# EasyEDA Pro project 交换机工具.epro, schematic Schematic1
Board Name: Board1; Create Date: 2026-06-15; Page Name: P1; Project Name: switch_tool2; Schematic Name: Schematic1; Update Date: 2026-06-25; Company: 嘉立创EDA; Page Size: A4; Version: V1.0
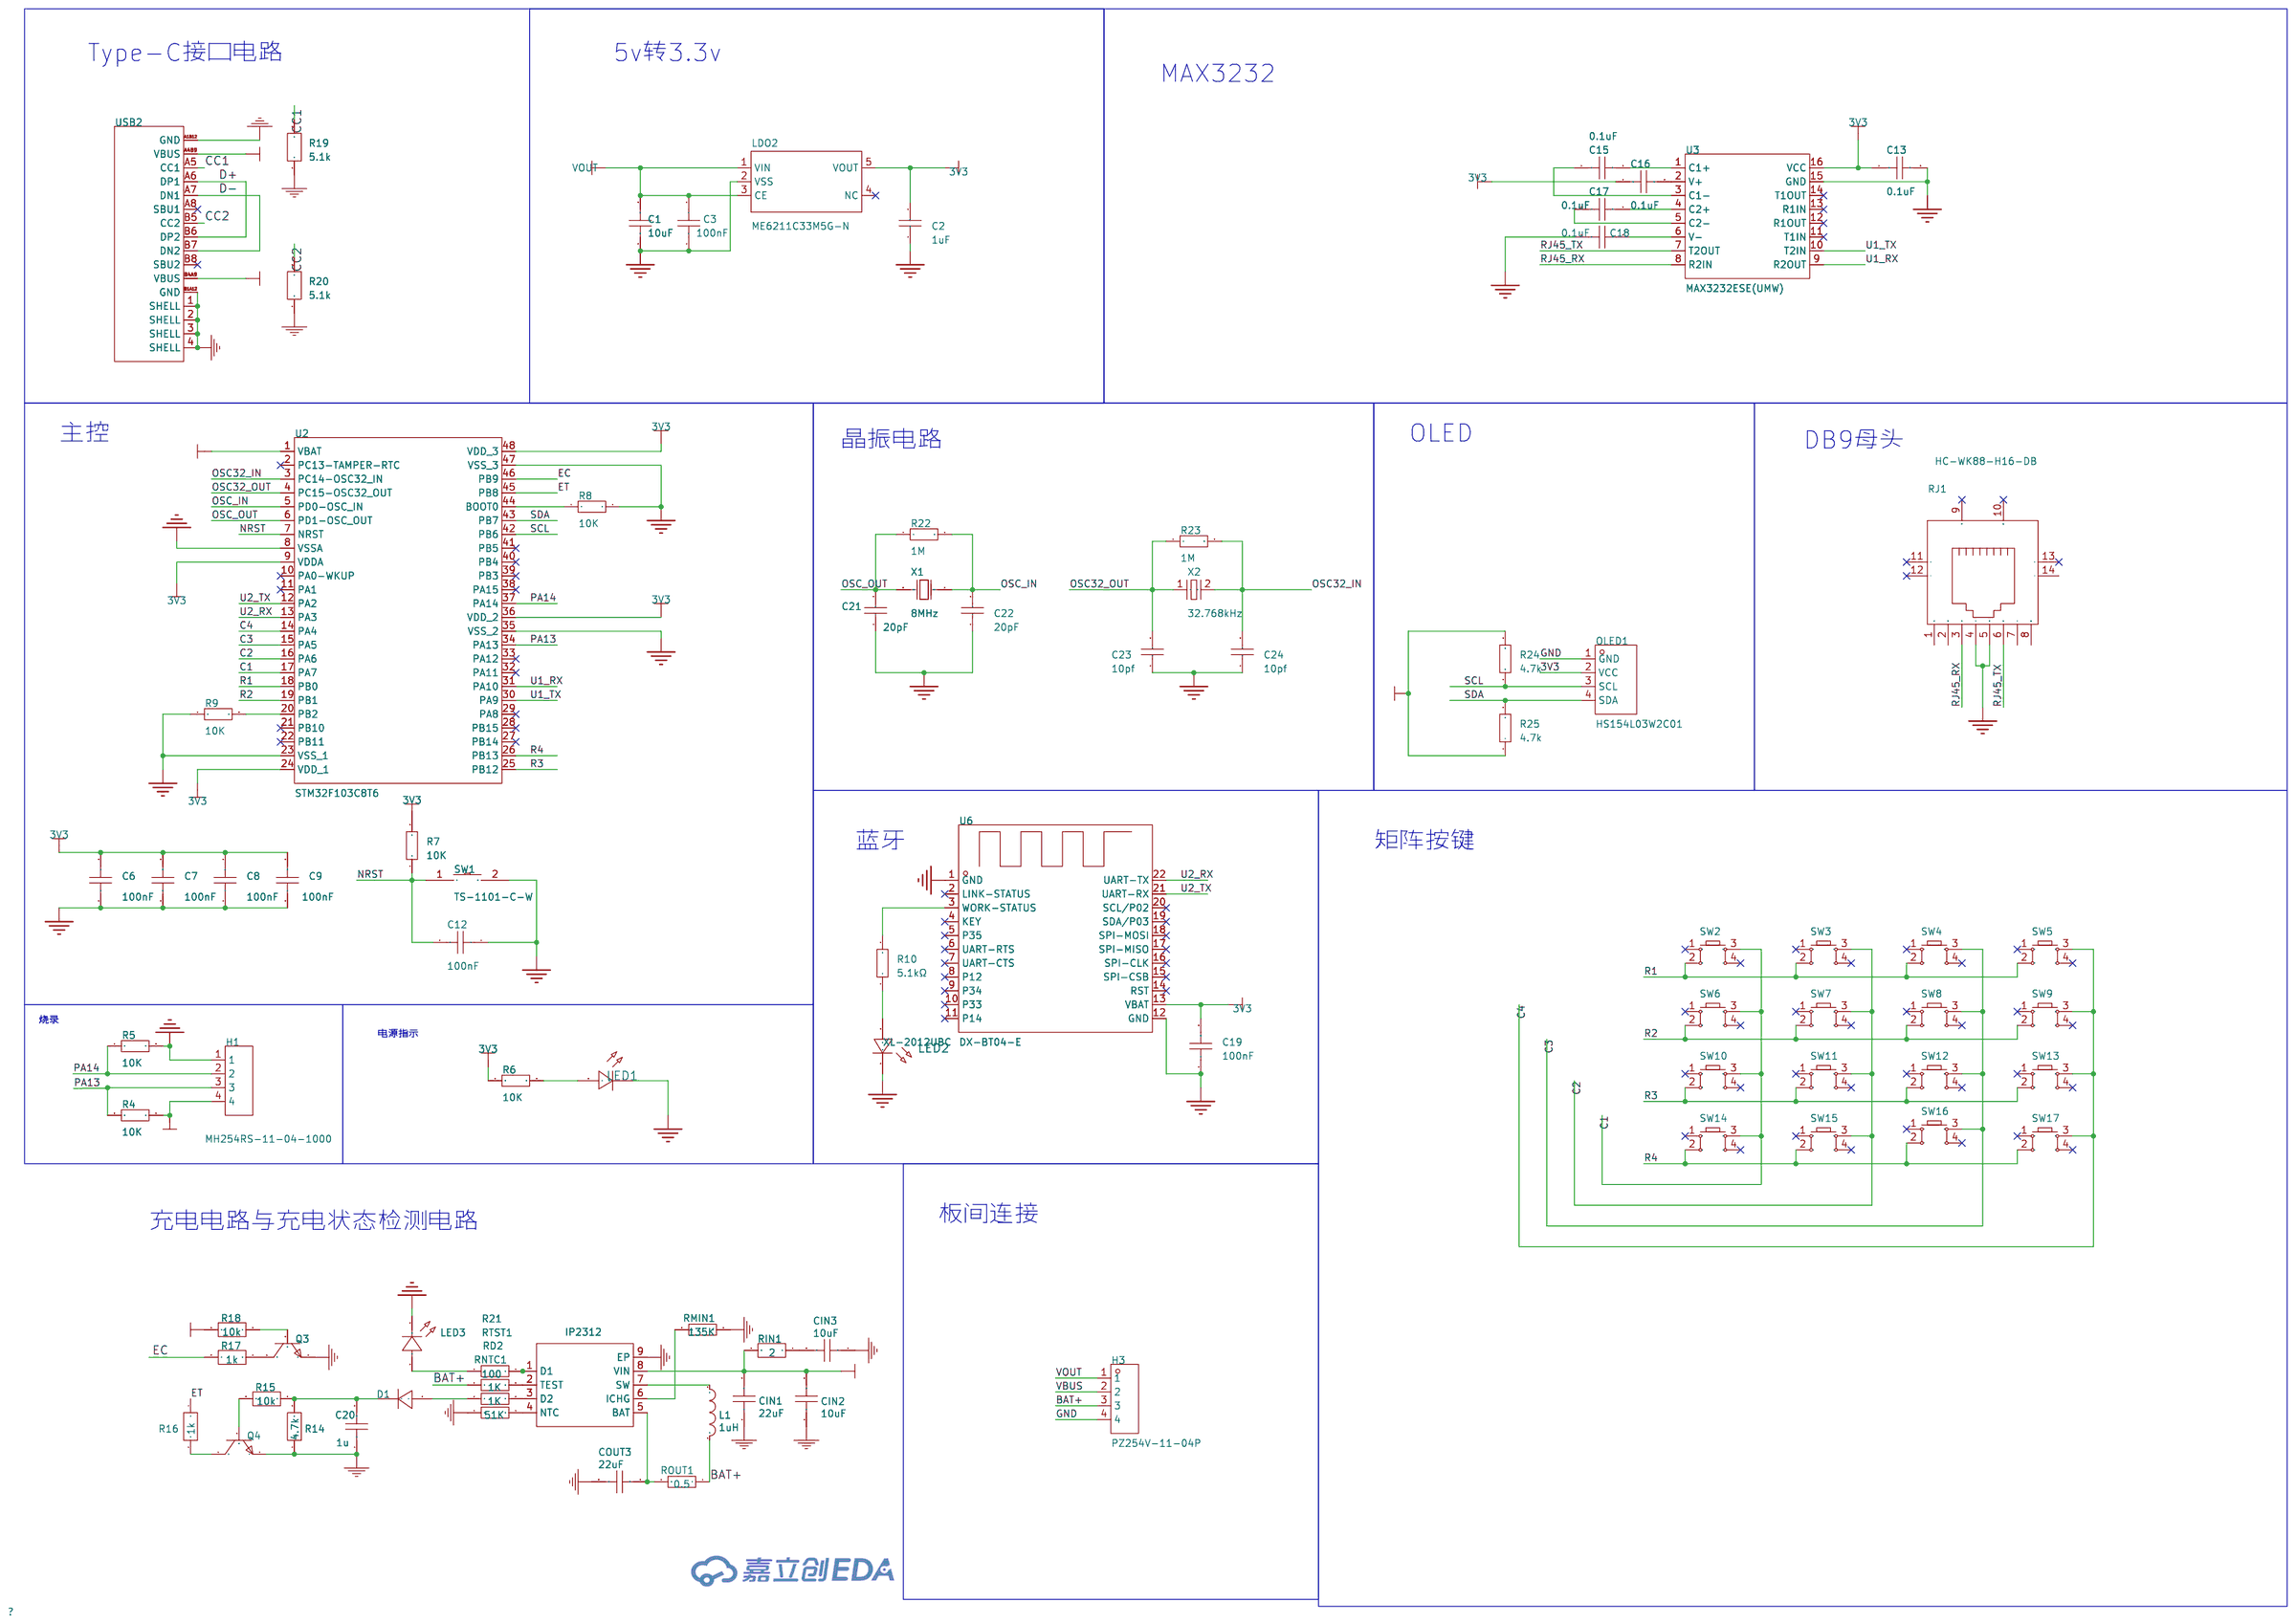
[diagram p1: schematic sheet]

## Parts
C1  10uF  [C0805]
C2  1uF  [C0805]
C3  100nF  [C0805]
C6  100nF  [C0805]
C7  100nF  [C0805]
C8  100nF  [C0805]
C9  100nF  [C0805]
C12  100nF  [C0805]
C13  0.1uF  [C0805]
C15  0.1uF  [C0805]
C16  0.1uF  [C0805]
C17  0.1uF  [C0805]
C18  0.1uF  [C0805]
C19  100nF  [C0805]
C20  1u  [C0805]
C21  20pF  [C0805]
C22  20pF  [C0805]
C23  10pf  [C0805]
C24  10pf  [C0805]
CIN1  22uF  [C0805]
CIN2  10uF  [C0805]
CIN3  10uF  [C0805]
COUT3  22uF  [C0805]
D1  1N4148W  [SOD-123F_L2.7-W1.6-LS3.8-RD]
H1  MH254RS-11-04-1000  [HDR-SMD_MH254RS-11-04-1000]
H3  PZ254V-11-04P  [HDR-TH_4P-P2.54-V-M]
IP2312  IP2312U_VSET  [SOP-8_L4.9-W3.9-P1.27-LS6.0-BL-EP]
L1  1uH  [IND-SMD_L4.6-W4.1_MHCI04015]
LDO2  ME6211C33M5G-N  [SOT-23-5_L3.0-W1.7-P0.95-LS2.8-BL]
LED1  -  [LED_0805]
LED2  XL-2012UBC  [LED_0805]
LED3  XL-2012UYC  [LED_0805]
OLED1  HS154L03W2C01  [OLED-TH_-4P-L42.4-W38.0-P2.54]
Q3  S8050  [SOT-23-3_L3.0-W1.7-P0.95-LS2.9-BR]
Q4  S8050-J3Y  [SOT-23-3_L2.9-W1.3-P0.95-LS2.4-BR-1]
R4  10K  [R0805]
R5  10K  [R0805]
R6  10K  [R0805]
R7  10K  [R0805]
R8  10K  [R0805]
R9  10K  [R0805]
R10  5.1kΩ  [R0805]
R14  4.7k  [R0805]
R15  10k  [R0805]
R16  1k  [R0805]
R17  1k  [R0805]
R18  10k  [R0805]
R19  5.1k  [R0805]
R20  5.1k  [R0805]
R21  100  [R0805]
R22  1M  [R0805]
R23  1M  [R0805]
R24  4.7k  [R0805]
R25  4.7k  [R0805]
RD2  1K  [R0805]
RIN1  2  [R0805]
RJ1  HC-WK88-H16-DB  [RJ45-TH_HC-WK88-H16-DB]
RMIN1  135K  [R0805]
RNTC1  51K  [R0805]
ROUT1  0.5  [R0805]
RTST1  1K  [R0805]
SW1  TS-1101-C-W  [SW-SMD_HX-TS-1101-C-W]
SW2  KH-6X6X5H-STM  [SW-SMD_4P-L6.0-W6.0-P4.50-LS9.0_H5.0]
SW3  KH-6X6X5H-STM  [SW-SMD_4P-L6.0-W6.0-P4.50-LS9.0_H5.0]
SW4  KH-6X6X5H-STM  [SW-SMD_4P-L6.0-W6.0-P4.50-LS9.0_H5.0]
SW5  KH-6X6X5H-STM  [SW-SMD_4P-L6.0-W6.0-P4.50-LS9.0_H5.0]
SW6  KH-6X6X5H-STM  [SW-SMD_4P-L6.0-W6.0-P4.50-LS9.0_H5.0]
SW7  KH-6X6X5H-STM  [SW-SMD_4P-L6.0-W6.0-P4.50-LS9.0_H5.0]
SW8  KH-6X6X5H-STM  [SW-SMD_4P-L6.0-W6.0-P4.50-LS9.0_H5.0]
SW9  KH-6X6X5H-STM  [SW-SMD_4P-L6.0-W6.0-P4.50-LS9.0_H5.0]
SW10  KH-6X6X5H-STM  [SW-SMD_4P-L6.0-W6.0-P4.50-LS9.0_H5.0]
SW11  KH-6X6X5H-STM  [SW-SMD_4P-L6.0-W6.0-P4.50-LS9.0_H5.0]
SW12  KH-6X6X5H-STM  [SW-SMD_4P-L6.0-W6.0-P4.50-LS9.0_H5.0]
SW13  KH-6X6X5H-STM  [SW-SMD_4P-L6.0-W6.0-P4.50-LS9.0_H5.0]
SW14  KH-6X6X5H-STM  [SW-SMD_4P-L6.0-W6.0-P4.50-LS9.0_H5.0]
SW15  KH-6X6X5H-STM  [SW-SMD_4P-L6.0-W6.0-P4.50-LS9.0_H5.0]
SW16  KH-6X6X5H-STM  [SW-SMD_4P-L6.0-W6.0-P4.50-LS9.0_H5.0]
SW17  KH-6X6X5H-STM  [SW-SMD_4P-L6.0-W6.0-P4.50-LS9.0_H5.0]
U2  STM32F103C8T6  [LQFP-48_L7.0-W7.0-P0.50-LS9.0-BL]
U3  MAX3232ESE(UMW)  [SOP-16_L9.9-W3.9-P1.27-LS6.0-BL]
U6  DX-BT04-E  [BULETM-SMD_DX-BT04-E]
USB2  TYPE-C16PIN  [USB-C-SMD_TYPE-C16PIN]
X1  8MHz  [CRYSTAL-SMD_L11.5-W4.8-LS12.7]
X2  32.768kHz  [CRYSTAL-SMD_L6.0-W3.0_SCPYS32X76800YERN]

## Library data of the parts
C1 = CL21A106KAYNNNE_C15850: 容值:10uF;精度:±10%;额定电压:25V;温度系数:X5R;; LCSC Part Name: 10uF ±10% 25V; Supplier Part: C15850; Manufacturer: SAMSUNG(三星); Manufacturer Part: CL21A106KAYNNNE; Supplier Footprint: 0805; JLCPCB Part Class: 基础库; Datasheet: https://item.szlcsc.com/datasheet/CL21A106KAYNNNE/16532.html; Supplier: LCSC; Tolerance: ±10%; Voltage Rating: 25V; Temperature Coefficient: X5R
C2 = CL21B105KBFNNNE: 容值:1uF;精度:±10%;额定电压:50V;温度系数:X7R;; LCSC Part Name: 1uF ±10% 50V; Supplier Part: C28323; Manufacturer: SAMSUNG(三星); Supplier Footprint: 0805; JLCPCB Part Class: 基础库; Datasheet: https://item.szlcsc.com/datasheet/CL21B105KBFNNNE/29074.html; Supplier: LCSC; Tolerance: ±10%; Voltage Rating: 50V; Temperature Coefficient: X7R
C3 C6-C9 C12 = CC0805KRX7R9BB104: 容值:100nF;精度:±10%;额定电压:50V;温度系数:X7R;; LCSC Part Name: 100nF ±10% 50V; Supplier Part: C49678; Manufacturer: YAGEO(国巨); Supplier Footprint: 0805; JLCPCB Part Class: 基础库; Datasheet: https://item.szlcsc.com/datasheet/CC0805KRX7R9BB104/50686.html; Supplier: LCSC; Tolerance: ±10%; Voltage Rating: 50V; Temperature Coefficient: X7R
C13 C15-C19 = CAP_0805: Supplier Footprint: 0805
C20 = 1u: nameAlias: Value(F); Contributor: LCEDA_Lib; spicePre: C; spiceSymbolName: C_0603_US
C21-C24 = CL21C200JBANNNC: 容值:20pF;精度:±5%;额定电压:50V;温度系数:C0G;; LCSC Part Name: 20pF ±5% 50V; Supplier Part: C1798; Manufacturer: SAMSUNG(三星); Supplier Footprint: 0805; JLCPCB Part Class: 基础库; Datasheet: https://item.szlcsc.com/datasheet/CL21C200JBANNNC/2150.html; Supplier: LCSC; Tolerance: ±5%; Voltage Rating: 50V; Temperature Coefficient: C0G
CIN1 COUT3 = 22uF: Supplier: LCSC; Supplier Part: C319197; Manufacturer: Taiyo Yuden; Manufacturer Part: EMK316ABJ226KL-T; nameAlias: Capacitance; Contributor: LCSC; spicePre: C; spiceSymbolName: EMK316ABJ226KL-T
CIN2 CIN3 = 10uF: Supplier: LCSC; Supplier Part: C513767; Manufacturer: Samwha Capacitor; Manufacturer Part: CS3216X7R106K250NRI; nameAlias: Capacitance; Contributor: LCSC; spicePre: C; spiceSymbolName: CS3216X7R106K250NRI
D1 = 1N4148W_C81598: 二极管配置:独立式;正向压降(Vf):1V@50mA;直流反向耐压(Vr):75V;整流电流:150mA;反向恢复时间(Trr):4ns;; Supplier Part: C81598; Manufacturer: ST(先科); Supplier Footprint: SOD-123; JLCPCB Part Class: Basic Part; Datasheet: https://item.szlcsc.com/datasheet/1N4148W/82750.html; Supplier: LCSC; Diode Configuration: 独立式; Voltage - Forward(Vf@If): 1V@50mA; Voltage - DC Reverse(Vr): 75V; Current - Rectified: 150mA; Pd - Power Dissipation: 400mW; Reverse Leakage Current (Ir): 1uA@75V; Reverse Recovery Time (trr): 4ns; Non-Repetitive Peak Forward Surge Current: 1A
H1 = MH254RS-11-04-1000: 插针结构:1x4P;间距:2.54mm;圆针/方针:圆针;安装方式:卧贴;排数:单排;总PIN位数:4P;额定电流:3A;配合针长度:3.5mm;触头材质:铜合金;触头镀层:金;工作温度:-55℃~+105℃;; LCSC Part Name: 1x4P 间距:2.54mm 圆针 卧贴; Supplier Part: C49056043; Manufacturer: XFCN(兴飞); Supplier Footprint: SMD,P=2.54mm,卧贴; JLCPCB Part Class: Extended Part; Datasheet: https://item.szlcsc.com/datasheet/MH254RS-11-04-1000/51423223.html; Supplier: LCSC; Pin Structure: 1x4P; Pitch: 2.54mm; Circluar Pins/Square Pins: 圆针; Mounting Type: 卧贴; Number of Rows: 单排; Number of Pins: 4P; Current Rating: 3A; Length of Mating Pin: 3.5mm; Contact Material: 铜合金; Contact Plating: 金; Operating Temperature: -55℃~+105℃
H3 = PZ254V-11-04P: 插针结构:1x4P;间距:2.54mm;行距:-;圆针/方针:方针;安装方式:直插;排数:单排;总PIN位数:4P;额定电流:3A;额定电压:250V;配合针长度:6mm;塑高:2.5mm;端接针长度:3mm;触头材质:-;工作温度:-40℃~+105℃;颜色:黑色;; LCSC Part Name: 1x4P 间距:2.54mm 方针 直插; Supplier Part: C2691448; Manufacturer: XFCN(兴飞); Supplier Footprint: 插件,P=2.54mm; JLCPCB Part Class: Extended Part; Datasheet: https://item.szlcsc.com/datasheet/PZ254V-11-04P/2801085.html; Supplier: LCSC; Pin Structure: 1x4P; Pitch: 2.54mm; Circluar Pins/Square Pins: 方针; Mounting Type: 直插; Number of Rows: 单排; Number of Pins: 4P; Current Rating: 3A; Voltage Rating (Max): 250V; Length of Mating Pin: 6mm; Insulation Height: 2.5mm; Length of End Connection Pin: 3mm; Operating Temperature: -40℃~+105℃; Color: 黑色
IP2312 = IP2312U_VSET: 工作电压:4.5V~5.5V;最大充电电流:3A;电池类型:锂电池;电池节数:1;; LCSC Part Name: 可调充满电压，通过1号脚调整 单节锂电池同步开关降压充电IC; Supplier Part: C605432; Manufacturer: INJOINIC(英集芯); Supplier Footprint: SOP-8-EP; JLCPCB Part Class: Extended Part; Datasheet: https://item.szlcsc.com/datasheet/IP2312U_VSET/635666.html; Supplier: LCSC; The Chip Type: 充电芯片; Voltage - Supply: 4.5V~5.5V; Charge Current - Max: 3A; Charging Saturation Voltage: 4.2V; Type of Battery: 锂电池; Number of Cells: 1; Operating Temperature: -40℃~+150℃; Battery Temperature Detection: 支持; Supply Current (Iq): 50uA
L1 = SRG0420-1R0-M: 电感值:1uH;精度:±20%;额定电流:5A;饱和电流(Isat):7A;类型:一体成型电感;; LCSC Part Name: 高电流功率电感器，无卤素，金属粉末磁芯，磁屏蔽低电磁干扰，高载流低磁芯损耗，符合RoHS标准; Supplier Part: C53462914; Manufacturer: JIERR(捷而瑞); Supplier Footprint: SMD,4.6x4.1mm; JLCPCB Part Class: Extended Part; Datasheet: https://item.szlcsc.com/datasheet/SRG0420-1R0-M/56628159.html; Supplier: LCSC; Tolerance: ±20%; Current Rating: 5A; Current - Saturation(Isat): 7A; DC Resistance(DCR): 24mΩ; Type: 一体成型电感
LDO2 = ME6211C33M5G-N: 输出极性:正极;工作电压:6V;输出电压:3.3V;输出电流:500mA;电源纹波抑制比(PSRR):70dB@(1kHz);输出类型:固定;; LCSC Part Name: 3.3V 500mA 6V; Supplier Part: C82942; Manufacturer: MICRONE(南京微盟); Supplier Footprint: SOT-23-5; JLCPCB Part Class: Extended Part; Datasheet: https://item.szlcsc.com/datasheet/ME6211C33M5G-N/84106.html; Supplier: LCSC; Output Configuration: 正极; Voltage - Supply: 6V; Output Voltage: 3.3V; Output Current: 500mA; Power Supply Rejection Ratio (PSRR): 70dB@(1kHz); Voltage Dropout: 120mV@(100mA); standby current: 60uA; Noise: 50uVrms; Features: 使能控制；短路保护；过流保护; Operating Temperature: -40℃~+150℃; Output Type: 固定; Number of Outputs: 1
LED1 = LED_0805-R: Supplier Footprint: 0805
LED2 = XL-2012UBC: 灯头类型:2.0mmx1.2mm方形灯头;发光颜色:蓝色;正向压降(Vf):3.2V;功率:70mW;正向电流:20mA;波长:460nm~475nm;二极管配置:独立二极管;透镜颜色:无色透明透镜;色温:-;发光强度:260mcd;发光角度:120°;载带方式:正贴;工作温度:-40℃~+85℃;; LCSC Part Name: 0805蓝贴片式发光二极管; Supplier Part: C965817; Manufacturer: XINGLIGHT(成兴光); Supplier Footprint: 0805; JLCPCB Part Class: Extended Part; Datasheet: https://item.szlcsc.com/datasheet/XL-2012UBC/1051426.html; Supplier: LCSC; Lamp Holder Type: 2.0mmx1.2mm方形灯头; Illumination Color: 蓝色; Voltage - Forward(Vf): 3.2V; Power(Watts): 70mW; Forward Current: 20mA; Wavelength - Dominant: 460nm~475nm; Peak Wavelength: 470nm; Diode Configuration: 独立二极管; Lens Color: 无色透明透镜; Luminous Intensity: 260mcd; Viewing Angle: 120°; Mounting Style: 正贴; Operating Temperature: -40℃~+85℃
LED3 = XL-2012UYC: 灯头类型:2.0mmx1.2mm方形灯头;发光颜色:黄色;正向压降(Vf):2.3V;功率:50mW;正向电流:20mA;波长:585nm~595nm;二极管配置:独立二极管;透镜颜色:无色透明透镜;色温:-;发光强度:80mcd~240mcd;发光角度:120°;载带方式:正贴;工作温度:-40℃~+85℃;; LCSC Part Name: 0805黄贴片式发光二极管; Supplier Part: C965814; Manufacturer: XINGLIGHT(成兴光); Supplier Footprint: 0805; JLCPCB Part Class: 扩展库; Datasheet: https://item.szlcsc.com/datasheet/XL-2012UYC/1051423.html; Supplier: LCSC; Lamp Holder Type: 2.0mmx1.2mm方形灯头; Illumination Color: 黄色; Voltage - Forward(Vf): 2.3V; Power(Watts): 50mW; Forward Current: 20mA; Wavelength - Dominant: 585nm~595nm; Peak Wavelength: 590nm; Diode Configuration: 独立二极管; Lens Color: 无色透明透镜; Luminous Intensity: 80mcd~240mcd; Viewing Angle: 120°; Mounting Style: 正贴; Operating Temperature: -40℃~+85℃
OLED1 = HS154L03W2C01: 主控芯片:SSD1309;接口类型:I2C;尺寸(inch):1.54;; LCSC Part Name: 1.54'1.54寸 128*64 OLED显示屏 I2C通讯 SH1106 白光; Supplier Part: C7465999; Manufacturer: HS(汉昇); JLCPCB Part Class: 扩展库; Datasheet: https://atta.szlcsc.com/upload/public/pdf/source/20230720/2DA92F251E43DB8385187BDFD94A5206.pdf; Supplier: LCSC; Main Control Chip: SSD1309; Interface Type: I2C; Size: 1.54; Operating Temperature: -40℃~+70℃
Q3 = S8050_C364312: 晶体管类型:NPN;集电极电流(Ic):500mA;集射极击穿电压(Vceo):25V;耗散功率(Pd):300mW;直流电流增益(hFE):-;; LCSC Part Name: hFE:200-350 NPN 电流:500mA 电压:25V; Supplier Part: C364312; Manufacturer: MDD(辰达半导体); Supplier Footprint: SOT-23; JLCPCB Part Class: Extended Part; Datasheet: https://item.szlcsc.com/datasheet/S8050/338624.html; Supplier: LCSC; type: NPN; Current - Collector(Ic): 500mA; Collector - Emitter Voltage VCEO: 25V; Pd - Power Dissipation: 300mW; Transition frequency(fT): 150MHz; Current - Collector Cutoff: 100nA; Vce Saturation(VCE(sat)): 600mV@500mA,50mA; Operating Temperature: -55℃~+150℃; Emitter-Base Voltage(Vebo): 5V
Q4 = S8050-J3Y: 晶体管类型:NPN;集电极电流(Ic):300mA;集射极击穿电压(Vceo):25V;耗散功率(Pd):300mW;直流电流增益(hFE):350@50mA,1V;; LCSC Part Name: hFE:200-300 NPN 电流:300mA 电压:25V; Supplier Part: C18221467; Manufacturer: JSMSEMI(杰盛微); Supplier Footprint: SOT-23; JLCPCB Part Class: Extended Part; Datasheet: https://item.szlcsc.com/datasheet/S8050-J3Y/19402088.html; Supplier: LCSC; type: NPN; Current - Collector(Ic): 300mA; Collector - Emitter Voltage VCEO: 25V; Pd - Power Dissipation: 300mW; DC Current Gain: 350@50mA,1V; Transition frequency(fT): 150MHz; Current - Collector Cutoff: 100nA; Vce Saturation(VCE(sat)): 600mV@500mA,50mA; Emitter-Base Voltage(Vebo): 5V
R4-R10 R21-R25 = Res_0805: Supplier Footprint: 0805
R14 = 4.7k: nameAlias: Value(Ω); Contributor: LCEDA_Lib; spicePre: R; spiceSymbolName: R_0603_EU
R15 R18 = 10k: nameAlias: Value(Ω); Contributor: LCEDA_Lib; spicePre: R; spiceSymbolName: R_0603_EU
R16 R17 = 1k: nameAlias: Value(Ω); Contributor: LCEDA_Lib; spicePre: R; spiceSymbolName: R_0603_EU
R19 R20 = 5.1k: nameAlias: Value(Ω); Contributor: LCEDA_Lib; spicePre: R; spiceSymbolName: R_0603_EU
RD2 RTST1 = 1K: Supplier: LCSC; Supplier Part: C269685; Manufacturer: Tyohm; Manufacturer Part: RMC06031K5%N; nameAlias: Resistance (Ohms); Contributor: LCSC; spicePre: R; spiceSymbolName: RMC06031K5%N
RIN1 = 2: Supplier: LCSC; Supplier Part: C227804; Manufacturer: YAGEO; Manufacturer Part: AC0603FR-072RL; nameAlias: Resistance (Ohms); Contributor: LCSC; spicePre: R; spiceSymbolName: AC0603FR-072RL
RJ1 = HC-WK88-H16-DB: 连接器类型:RJ45插座;安装方式:弯插;端口数量:1;LED:带LED;屏蔽:有屏蔽;等级:-;触头材质:铜;触头镀层:金;工作温度:-25℃~+70℃;; LCSC Part Name: 弯插 带LED 网口 RJ45-8P8C-16H半包 带灯 不锈钢壳 B款; Supplier Part: C7501824; Manufacturer: HC(虹成电子); Supplier Footprint: 插件; JLCPCB Part Class: 扩展库; Datasheet: https://item.szlcsc.com/datasheet/HC-WK88-H16-DB/8585365.html; Supplier: LCSC; Connector Type: RJ45插座; Mounting Type: 弯插; Number of Ports: 1; LED: 带LED; Shielding: 有屏蔽; Contact Material: 铜; Contact Plating: 金; Operating Temperature: -25℃~+70℃
RMIN1 = 135K: Supplier: LCSC; Supplier Part: C177539; Manufacturer: Hong Kong Resistors; Manufacturer Part: RCT0345K3FLF; nameAlias: Resistance (Ohms); Contributor: LCSC; spicePre: R; spiceSymbolName: RCT0345K3FLF
RNTC1 = 51K: Supplier: LCSC; Supplier Part: C269685; Manufacturer: Tyohm; Manufacturer Part: RMC06031K5%N; nameAlias: Resistance (Ohms); Contributor: LCSC; spicePre: R; spiceSymbolName: RMC06031K5%N
ROUT1 = 0.5: Supplier: LCSC; Manufacturer: UniOhm; Manufacturer Part: 0603WAF500LT5E; Supplier Part: C45312; JLCPCB Part Class: Extend; JLCPCB SMD: Yes; nameAlias: Resistance (Ohms); spicePre: R; spiceSymbolName: 0603WAF500LT5E
SW1 = TS-1101-C-W: 电路结构:单刀单掷;按钮形状:矩形按钮;作用力:2.6N;安装方式:立贴;开关长度:6mm;开关宽度:3.6mm;开关高度:2.5mm;带支架:不带支架;触点电流:50mA;额定电压:12V;带灯:无;工作寿命:5万次;; LCSC Part Name: 6*3.6*2.5mm 立贴 轻触开关; Supplier Part: C318938; Manufacturer: XKB Connection(中国星坤); Supplier Footprint: SMD,6x3.6mm; JLCPCB Part Class: 扩展库; Datasheet: https://item.szlcsc.com/datasheet/TS-1101-C-W/300030.html; Supplier: LCSC; Circuit: 单刀单掷; Actuator Style: 矩形按钮; Operating Force: 2.6N; Mounting Type: 立贴; Length: 6mm; Width: 3.6mm; Switch Height: 2.5mm; with Bracket: 不带支架; Contact Current: 50mA; Voltage Rating: 12V; With Lamp: 无; Life: 5万次; Operating Temperature: -30℃~+85℃
SW2-SW17 = KH-6X6X5H-STM: 电路结构:单刀单掷;按钮形状:圆形按钮;安装方式:立贴;开关长度:6mm;开关宽度:6mm;开关高度:5mm;带支架:不带支架;触点电流:50mA;额定电压:12V;工作寿命:8万次;; LCSC Part Name: 6*6*5mm 立贴 轻触开关; Supplier Part: C2837531; Manufacturer: kinghelm(金航标); Supplier Footprint: SMD-4P,6x6mm; JLCPCB Part Class: Extended Part; Datasheet: https://item.szlcsc.com/datasheet/KH-6X6X5H-STM/3009601.html; Supplier: LCSC; Circuit: 单刀单掷; Actuator Style: 圆形按钮; Mounting Type: 立贴; Length: 6mm; Width: 6mm; Switch Height: 5mm; with Bracket: 不带支架; Contact Current: 50mA; Voltage Rating: 12V; Actuator/Cap Color: 黑色; Termination Style: 鸥翼型; Life: 8万次
U2 = STM32F103C8T6: CPU内核:ARM-M3;CPU最大主频:72MHz;应用领域:-;; LCSC Part Name: 主流增强型ARM Cortex-M3 MCU，具有64 KB Flash、72 MHz CPU、电机控制、USB和CAN; Supplier Part: C8734; Manufacturer: ST(意法半导体); Supplier Footprint: LQFP-48(7x7); JLCPCB Part Class: Extended Part; Datasheet: https://item.szlcsc.com/datasheet/STM32F103C8T6/9243.html; Supplier: LCSC; CPU Core: ARM-M3; CPU Maximum Speed: 72MHz; Program Storage Size: 64KB; Program Memory Type: FLASH; Number of I/O: 37; ADC (Bit): 12bit; Voltage - Supply: 2V~3.6V
U3 = MAX3232ESE(UMW): 类型:收发器;数据速率:250Kbps;; LCSC Part Name: 3.0V至5.5V低功率多通道RS-232线收发器 使用0.1μF外部电容; Supplier Part: C2904738; Manufacturer: UMW(友台半导体); Supplier Footprint: SOP-16; JLCPCB Part Class: Extended Part; Datasheet: https://item.szlcsc.com/datasheet/MAX3232ESE(UMW)/3170777.html; Supplier: LCSC; Type: 收发器; Number of Drivers: 2; Number of Receivers: 2; Data Rate: 250Kbps; Voltage - Supply: 3V~3.6V；4.5V~5.5V; ESD Protect: ±8kV; charge pump: 有; Operating Temperature: -40℃~+105℃; Supply Current (Iq): 1mA
U6 = DX-BT04-E: Supplier Part: C2892698; Supplier Footprint: SMD-22_11.4X16.1X1.10P; JLCPCB Part Class: 扩展库; Supplier: LCSC
USB2 = TYPE-C16PIN: 连接器类型:Type-C;协议标准:-;公母:母;安装方式:卧贴;触点数量:16P;端口数量:1;额定电流 - 电源:3A;工作温度:-40℃~+85℃;; LCSC Part Name: 16P卧贴母座; Supplier Part: C393939; Manufacturer: SHOU HAN(首韩); Supplier Footprint: SMD; JLCPCB Part Class: Extended Part; Datasheet: https://item.szlcsc.com/datasheet/TYPE-C16PIN/372551.html; Supplier: LCSC; Connector Type: Type-C; Gender: 母; Mounting Type: 卧贴; Number of Contacts: 16P; Number of Ports: 1; Current Rating-Power: 3A; Voltage Rating: 30V; Connect-Disconnect Life: 1万次; Detection color: 黑色; Operating Temperature: -40℃~+85℃
X1 = X49SM8MSD2SC: 晶振类型:贴片晶振;频率:8MHz;常温频差:±20ppm;负载电容:20pF;频率稳定度:±30ppm;; LCSC Part Name: HC-49SMD 8MHZ 20PF ±20PPM -20~70℃（±30PPM）; Supplier Part: C12674; Manufacturer: YXC(扬兴晶振); Supplier Footprint: HC-49S-SMD; JLCPCB Part Class: 基础库; Datasheet: https://item.szlcsc.com/datasheet/X49SM8MSD2SC/13310.html; Supplier: LCSC; Type: 贴片晶振; Normal temperature Frequency Tolerance: ±20ppm; Load Capacitance: 20pF; Frequency Stability: ±30ppm; Operating Temperature: -20℃~+70℃
X2 = SCPYS32X76800YERN: 频率:32.768kHz;常温频差:±20ppm;负载电容:12.5pF;频率稳定度:±30ppm;; LCSC Part Name: 32.768kHz ±20ppm 12.5pF; Supplier Part: C20200125; Manufacturer: SOSET(索斯特); Supplier Footprint: HC-49S-SMD; JLCPCB Part Class: 扩展库; Datasheet: https://item.szlcsc.com/datasheet/SCPYS32X76800YERN/21526198.html; Supplier: LCSC; Normal temperature Frequency Tolerance: ±20ppm; Load Capacitance: 12.5pF; Frequency Stability: ±30ppm; Operating Temperature: -40℃~+85℃

## Nets
3V3: C2.2 C6.2 C7.2 C8.2 C9.2 C13.1 C16.1 C19.2 H1.4 LDO2.5(VOUT) OLED1.2(VCC) R4.2 R6.1 R7.2 R24.2 R25.1 U2.1(VBAT) U2.9(VDDA) U2.24(VDD_1) U2.36(VDD_2) U2.48(VDD_3) U3.16(VCC) U6.13(VBAT)
GND: C1.1 C2.1 C3.1 C6.1 C7.1 C8.1 C9.1 C12.1 C13.2 C18.1 C19.1 C20.1 C21.1 C22.1 C23.1 C24.1 CIN1.1 CIN2.1 CIN3.1 COUT3.2 H1.1 H3.4 IP2312.9(EP) LDO2.2(VSS) LED1.1(C) LED2.1(C) LED3.1(K) OLED1.1(GND) Q3.2(E) Q4.2(E) R5.2 R8.2 R9.1 R14.1 R19.2 R20.2 RJ1.4 RJ1.5 RMIN1.1 RNTC1.1 SW1.2 U2.8(VSSA) U2.23(VSS_1) U2.35(VSS_2) U2.47(VSS_3) U3.15(GND) U6.1(GND) U6.12(GND) USB2.1(SHELL) USB2.2(SHELL) USB2.3(SHELL) USB2.4(SHELL) USB2.A1B12(GND) USB2.B1A12(GND)
VBUS: CIN1.2 CIN2.2 H3.2 IP2312.8(VIN) R18.2 RIN1.2 USB2.A4B9(VBUS) USB2.B4A9(VBUS)
BAT+: H3.3 L1.2 ROUT1.1 RTST1.1
C1: SW2.3 SW6.3 SW10.3 SW14.3 U2.17(PA7)
C2: SW3.3 SW7.3 SW11.3 SW15.3 U2.16(PA6)
C3: SW4.3 SW8.3 SW12.3 SW16.3 U2.15(PA5)
C4: SW5.3 SW9.3 SW13.3 SW17.3 U2.14(PA4)
CC1: R19.1 USB2.A5(CC1)
CC2: R20.1 USB2.B5(CC2)
D+: USB2.A6(DP1) USB2.B6(DP2)
D-: USB2.A7(DN1) USB2.B7(DN2)
EC: R17.2 U2.46(PB9)
ET: R16.1 U2.45(PB8)
NRST: C12.2 R7.1 SW1.1 U2.7(NRST)
OSC32_IN: C24.2 R23.2 U2.3(PC14-OSC32_IN) X2.2(GND)
OSC32_OUT: C23.2 R23.1 U2.4(PC15-OSC32_OUT) X2.1
OSC_IN: C22.2 R22.2 U2.5(PD0-OSC_IN) X1.1(OSC1)
OSC_OUT: C21.2 R22.1 U2.6(PD1-OSC_OUT) X1.2(OSC2)
PA13: H1.3 R4.1 U2.34(PA13)
PA14: H1.2 R5.1 U2.37(PA14)
R1: SW2.2 SW3.2 SW4.2 SW5.2 U2.18(PB0)
R2: SW6.2 SW7.2 SW8.2 SW9.2 U2.19(PB1)
R3: SW10.2 SW11.2 SW12.2 SW13.2 U2.25(PB12)
R4: SW14.2 SW15.2 SW16.2 SW17.2 U2.26(PB13)
RJ45_RX: RJ1.3 U3.8(R2IN)
RJ45_TX: RJ1.6 U3.7(T2OUT)
SCL: OLED1.3(SCL) R24.1 U2.42(PB6)
SDA: OLED1.4(SDA) R25.2 U2.43(PB7)
U1_RX: U2.31(PA10) U3.9(R2OUT)
U1_TX: U2.30(PA9) U3.10(T2IN)
U2_RX: U2.13(PA3) U6.22(UART-TX)
U2_TX: U2.12(PA2) U6.21(UART-RX)
VOUT: C1.2 C3.2 H3.1 LDO2.1(VIN) LDO2.3(CE)
$1N5805: LED1.2(A) R6.2
$1N6642: R8.1 U2.44(BOOT0)
$1N6713: R9.2 U2.20(PB2)
$1N7190: C15.2 U3.1(C1+)
$1N7397: C17.2 U3.4(C2+)
$1N7404: C18.2 U3.6(V-)
$1N7408: C17.1 U3.5(C2-)
$1N10752: R10.2 U6.3(WORK-STATUS)
$1N10781: LED2.2(A) R10.1
$1N13418: COUT3.1 IP2312.5(BAT) ROUT1.2
$1N13419: IP2312.7(SW) L1.1
$1N13420: IP2312.6(ICHG) RMIN1.2
$1N13421: D1.2(A) RD2.1
$1N13422: IP2312.1(D1) R21.1
$1N13425: C20.2 D1.1(K) R14.2 R15.1
$1N13431: Q3.1(B) R18.1
$1N13432: Q4.1(B) R15.2
$1N13433: Q4.3(C) R16.2
$1N13437: IP2312.3(D2) RD2.2
$1N13439: IP2312.2(TEST) RTST1.2
$1N13444: CIN3.2 RIN1.1
$1N13445: IP2312.4(NTC) RNTC1.2
$1N13446: Q3.3(C) R17.1
$1N15528: LED3.2(A) R21.2
$1N31315: C15.1 U3.3(C1-)
$1N31322: C16.2 U3.2(V+)

Not connected (* = marked no-connect by the designer): LDO2 4(NC)*; RJ1 1 2 7 8 9* 10* 11(+)* 12(-)* 13(+)* 14(-); SW2 1* 4*; SW3 1* 4*; SW4 1* 4*; SW5 1* 4*; SW6 1* 4*; SW7 1* 4*; SW8 1* 4*; SW9 1* 4*; SW10 1* 4*; SW11 1* 4*; SW12 1* 4*; SW13 1* 4*; SW14 1* 4*; SW15 1* 4*; SW16 1* 4*; SW17 1* 4*; U2 2(PC13-TAMPER-RTC)* 10(PA0-WKUP)* 11(PA1)* 21(PB10)* 22(PB11)* 27(PB14)* 28(PB15)* 29(PA8)* 32(PA11)* 33(PA12)* 38(PA15)* 39(PB3)* 40(PB4)* 41(PB5)*; U3 11(T1IN)* 12(R1OUT)* 13(R1IN)* 14(T1OUT)*; U6 2(LINK-STATUS)* 4(KEY)* 5(P35)* 6(UART-RTS)* 7(UART-CTS)* 8(P12)* 9(P34)* 10(P33)* 11(P14)* 14(RST)* 15(SPI-CSB)* 16(SPI-CLK)* 17(SPI-MISO)* 18(SPI-MOSI)* 19(SDA/P03)* 20(SCL/P02)*; USB2 A8(SBU1)* B8(SBU2)*

## Notes on the sheet
- Type-C接口电路
- 5v转3.3v
- MAX3232
- 主控
- 晶振电路
- OLED
- DB9母头
- 蓝牙
- 矩阵按键
- 烧录
- 电源指示
- 充电电路与充电状态检测电路
- 板间连接
